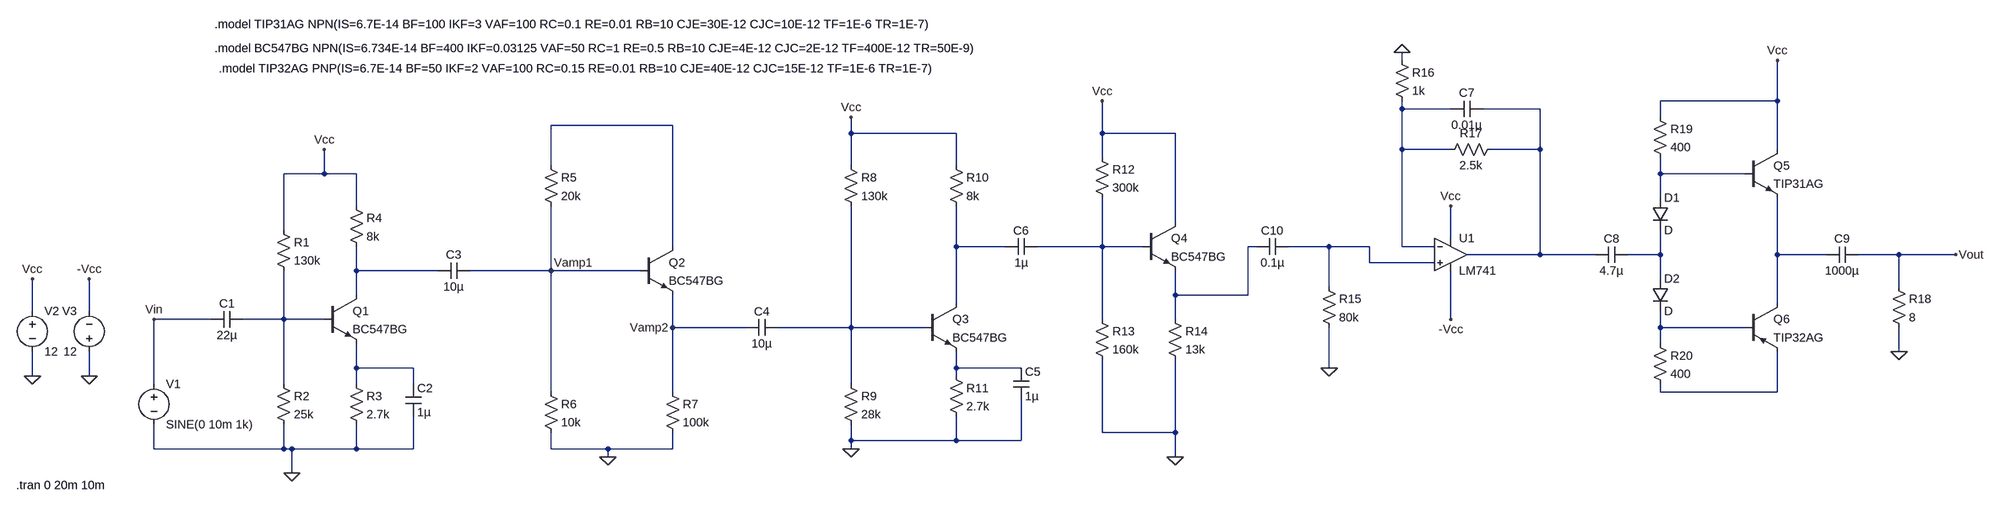
[diagram p0: schematic proje_deneme_cagatay.asc]
proje_deneme_cagatay.asc, the LTspice schematic file:
Version 4
SHEET 1 3752 680
WIRE 2512 -480 2512 -496
WIRE 3328 -400 3328 -480
WIRE 3328 -400 3040 -400
WIRE 2512 -384 2512 -400
WIRE 2608 -384 2512 -384
WIRE 2784 -384 2672 -384
WIRE 3040 -368 3040 -400
WIRE 1072 -352 832 -352
WIRE 1424 -336 1424 -368
WIRE 1632 -336 1424 -336
WIRE 1920 -336 1920 -400
WIRE 2064 -336 1920 -336
WIRE 2512 -304 2512 -384
WIRE 2608 -304 2512 -304
WIRE 2784 -304 2784 -384
WIRE 2784 -304 2688 -304
WIRE 3328 -304 3328 -400
WIRE 1920 -288 1920 -336
WIRE 832 -272 832 -352
WIRE 1424 -272 1424 -336
WIRE 1632 -272 1632 -336
WIRE 384 -256 384 -304
WIRE 384 -256 304 -256
WIRE 448 -256 384 -256
WIRE 3040 -256 3040 -288
WIRE 3264 -256 3040 -256
WIRE 3040 -208 3040 -256
WIRE 448 -192 448 -256
WIRE 2064 -160 2064 -336
WIRE 304 -144 304 -256
WIRE 2608 -128 2608 -192
WIRE 1072 -112 1072 -352
WIRE 1632 -112 1632 -192
WIRE 1728 -112 1632 -112
WIRE 1920 -112 1920 -208
WIRE 1920 -112 1792 -112
WIRE 2000 -112 1920 -112
WIRE 2224 -112 2208 -112
WIRE 2368 -112 2288 -112
WIRE 2448 -112 2368 -112
WIRE 2512 -112 2512 -304
WIRE 2576 -112 2512 -112
WIRE 2784 -96 2784 -304
WIRE 2784 -96 2640 -96
WIRE 2912 -96 2784 -96
WIRE 3040 -96 3040 -144
WIRE 3040 -96 2976 -96
WIRE 3328 -96 3328 -208
WIRE 3424 -96 3328 -96
WIRE 3568 -96 3488 -96
WIRE 3680 -96 3568 -96
WIRE 2448 -80 2448 -112
WIRE 2576 -80 2448 -80
WIRE 448 -64 448 -112
WIRE 608 -64 448 -64
WIRE 832 -64 832 -192
WIRE 832 -64 672 -64
WIRE 1008 -64 832 -64
WIRE 3040 -48 3040 -96
WIRE 2368 -32 2368 -112
WIRE 3568 -32 3568 -96
WIRE 448 -16 448 -64
WIRE 2064 -16 2064 -64
WIRE 2208 -16 2208 -112
WIRE 2208 -16 2064 -16
WIRE 1632 0 1632 -112
WIRE 3328 0 3328 -96
WIRE -192 16 -192 -48
WIRE -80 16 -80 -48
WIRE 160 32 48 32
WIRE 304 32 304 -64
WIRE 304 32 224 32
WIRE 384 32 304 32
WIRE 1920 32 1920 -112
WIRE 2064 32 2064 -16
WIRE 2608 32 2608 -64
WIRE 1072 48 1072 -16
WIRE 1216 48 1072 48
WIRE 1424 48 1424 -192
WIRE 1424 48 1280 48
WIRE 1568 48 1424 48
WIRE 3040 48 3040 16
WIRE 3264 48 3040 48
WIRE 3040 80 3040 48
WIRE 3568 96 3568 48
WIRE 448 128 448 80
WIRE 560 128 448 128
WIRE 1632 128 1632 96
WIRE 1760 128 1632 128
WIRE 2368 128 2368 48
WIRE -192 144 -192 96
WIRE -80 144 -80 96
WIRE 1632 144 1632 128
WIRE 48 160 48 32
WIRE 304 160 304 32
WIRE 448 160 448 128
WIRE 560 160 560 128
WIRE 1424 160 1424 48
WIRE 832 176 832 -64
WIRE 1072 176 1072 48
WIRE 3040 176 3040 160
WIRE 3328 176 3328 96
WIRE 3328 176 3040 176
WIRE 1920 256 1920 112
WIRE 2064 256 2064 112
WIRE 2064 256 1920 256
WIRE 1424 272 1424 240
WIRE 1632 272 1632 224
WIRE 1632 272 1424 272
WIRE 1760 272 1760 192
WIRE 1760 272 1632 272
WIRE 48 288 48 240
WIRE 304 288 304 240
WIRE 304 288 48 288
WIRE 320 288 304 288
WIRE 448 288 448 240
WIRE 448 288 320 288
WIRE 560 288 560 224
WIRE 560 288 448 288
WIRE 832 288 832 256
WIRE 944 288 832 288
WIRE 1072 288 1072 256
WIRE 1072 288 944 288
WIRE 1424 288 1424 272
WIRE 944 304 944 288
WIRE 2064 304 2064 256
WIRE 320 336 320 288
FLAG -192 144 0
FLAG 320 336 0
FLAG 944 304 0
FLAG 1424 288 0
FLAG 2064 304 0
FLAG 2368 128 0
FLAG 2512 -496 0
FLAG 3568 96 0
FLAG 3328 -480 Vcc
FLAG 2608 -192 Vcc
FLAG 2608 32 -Vcc
FLAG 3680 -96 Vout
FLAG 1920 -400 Vcc
FLAG 1424 -368 Vcc
FLAG 384 -304 Vcc
FLAG -192 -48 Vcc
FLAG -80 144 0
FLAG -80 -48 -Vcc
FLAG 48 32 Vin
FLAG 832 -64 Vamp1
FLAG 1072 48 Vamp2
SYMBOL voltage 48 144 R0
WINDOW 123 0 0 Left 0
WINDOW 39 0 0 Left 0
SYMATTR InstName V1
SYMATTR Value SINE(0 10m 1k)
SYMBOL cap 224 16 R90
WINDOW 0 0 32 VBottom 2
WINDOW 3 32 32 VTop 2
SYMATTR InstName C1
SYMATTR Value 22µ
SYMBOL npn 384 -16 R0
SYMATTR InstName Q1
SYMATTR Value BC547BG
SYMBOL res 288 -160 R0
SYMATTR InstName R1
SYMATTR Value 130k
SYMBOL res 288 144 R0
SYMATTR InstName R2
SYMATTR Value 25k
SYMBOL res 432 144 R0
SYMATTR InstName R3
SYMATTR Value 2.7k
SYMBOL cap 544 160 R0
SYMATTR InstName C2
SYMATTR Value 1µ
SYMBOL res 432 -208 R0
SYMATTR InstName R4
SYMATTR Value 8k
SYMBOL cap 672 -80 R90
WINDOW 0 0 32 VBottom 2
WINDOW 3 32 32 VTop 2
SYMATTR InstName C3
SYMATTR Value 10µ
SYMBOL voltage -192 0 R0
WINDOW 123 0 0 Left 0
WINDOW 39 0 0 Left 0
SYMATTR InstName V2
SYMATTR Value 12
SYMBOL res 816 -288 R0
SYMATTR InstName R5
SYMATTR Value 20k
SYMBOL res 816 160 R0
SYMATTR InstName R6
SYMATTR Value 10k
SYMBOL res 1056 160 R0
SYMATTR InstName R7
SYMATTR Value 100k
SYMBOL cap 1280 32 R90
WINDOW 0 0 32 VBottom 2
WINDOW 3 32 32 VTop 2
SYMATTR InstName C4
SYMATTR Value 10µ
SYMBOL npn 1008 -112 R0
SYMATTR InstName Q2
SYMATTR Value BC547BG
SYMBOL res 1408 -288 R0
SYMATTR InstName R8
SYMATTR Value 130k
SYMBOL res 1408 144 R0
SYMATTR InstName R9
SYMATTR Value 28k
SYMBOL res 1616 -288 R0
SYMATTR InstName R10
SYMATTR Value 8k
SYMBOL res 1616 128 R0
SYMATTR InstName R11
SYMATTR Value 2.7k
SYMBOL cap 1744 128 R0
SYMATTR InstName C5
SYMATTR Value 1µ
SYMBOL npn 1568 0 R0
SYMATTR InstName Q3
SYMATTR Value BC547BG
SYMBOL cap 1792 -128 R90
WINDOW 0 0 32 VBottom 2
WINDOW 3 32 32 VTop 2
SYMATTR InstName C6
SYMATTR Value 1µ
SYMBOL res 1904 -304 R0
SYMATTR InstName R12
SYMATTR Value 300k
SYMBOL res 1904 16 R0
SYMATTR InstName R13
SYMATTR Value 160k
SYMBOL res 2048 16 R0
SYMATTR InstName R14
SYMATTR Value 13k
SYMBOL npn 2000 -160 R0
SYMATTR InstName Q4
SYMATTR Value BC547BG
SYMBOL res 2352 -48 R0
SYMATTR InstName R15
SYMATTR Value 80k
SYMBOL OpAmps\\LM741 2608 -160 R0
SYMATTR InstName U1
SYMBOL res 2496 -496 R0
SYMATTR InstName R16
SYMATTR Value 1k
SYMBOL cap 2672 -400 R90
WINDOW 0 0 32 VBottom 2
WINDOW 3 32 32 VTop 2
SYMATTR InstName C7
SYMATTR Value 0.01µ
SYMBOL res 2704 -320 R90
WINDOW 0 0 56 VBottom 2
WINDOW 3 32 56 VTop 2
SYMATTR InstName R17
SYMATTR Value 2.5k
SYMBOL cap 2976 -112 R90
WINDOW 0 0 32 VBottom 2
WINDOW 3 32 32 VTop 2
SYMATTR InstName C8
SYMATTR Value 4.7µ
SYMBOL res 3552 -48 R0
SYMATTR InstName R18
SYMATTR Value 8
SYMBOL cap 3488 -112 R90
WINDOW 0 0 32 VBottom 2
WINDOW 3 32 32 VTop 2
SYMATTR InstName C9
SYMATTR Value 1000µ
SYMBOL res 3024 -384 R0
SYMATTR InstName R19
SYMATTR Value 400
SYMBOL res 3024 64 R0
SYMATTR InstName R20
SYMATTR Value 400
SYMBOL npn 3264 -304 R0
SYMATTR InstName Q5
SYMATTR Value TIP31AG
SYMBOL voltage -80 112 R180
WINDOW 0 24 96 Left 2
WINDOW 3 24 16 Left 2
WINDOW 123 0 0 Left 0
WINDOW 39 0 0 Left 0
SYMATTR InstName V3
SYMATTR Value 12
SYMBOL cap 2288 -128 R90
WINDOW 0 0 32 VBottom 2
WINDOW 3 32 32 VTop 2
SYMATTR InstName C10
SYMATTR Value 0.1µ
SYMBOL diode 3024 -208 R0
SYMATTR InstName D1
SYMBOL diode 3024 -48 R0
SYMATTR InstName D2
SYMBOL pnp 3264 0 R0
SYMATTR InstName Q6
SYMATTR Value TIP32AG
TEXT -224 360 Left 2 !.tran 0 20m 10m
TEXT 168 -504 Left 2 !.model BC547BG NPN(IS=6.734E-14 BF=400 IKF=0.03125 VAF=50 RC=1 RE=0.5 RB=10 CJE=4E-12 CJC=2E-12 TF=400E-12 TR=50E-9)
TEXT 168 -552 Left 2 !.model TIP31AG NPN(IS=6.7E-14 BF=100 IKF=3 VAF=100 RC=0.1 RE=0.01 RB=10 CJE=30E-12 CJC=10E-12 TF=1E-6 TR=1E-7)
TEXT 176 -464 Left 2 !.model TIP32AG PNP(IS=6.7E-14 BF=50 IKF=2 VAF=100 RC=0.15 RE=0.01 RB=10 CJE=40E-12 CJC=15E-12 TF=1E-6 TR=1E-7)

The netlist it stands for:
* proje_deneme_cagatay.asc
V1 Vin 0 SINE(0 10m 1k)
C1 N012 Vin 22µ
Q1 N011 N012 N015 0 BC547BG
R1 Vcc N012 130k
R2 N012 0 25k
R3 N015 0 2.7k
C2 N015 0 1µ
R4 Vcc N011 8k
C3 Vamp1 N011 10µ
V2 Vcc 0 12
R5 N003 Vamp1 20k
R6 Vamp1 0 10k
R7 Vamp2 0 100k
C4 N013 Vamp2 10µ
Q2 N003 Vamp1 Vamp2 0 BC547BG
R8 Vcc N013 130k
R9 N013 0 28k
R10 Vcc N005 8k
R11 N016 0 2.7k
C5 N016 0 1µ
Q3 N005 N013 N016 0 BC547BG
C6 N006 N005 1µ
R12 Vcc N006 300k
R13 N006 0 160k
R14 N007 0 13k
Q4 Vcc N006 N007 0 BC547BG
R15 N008 0 80k
XU1 N008 N001 Vcc -Vcc N002 LM741  ; pins In+ In- V+ V- OUT
R16 0 N001 1k
C7 N002 N001 0.01µ
R17 N002 N001 2.5k
C8 N009 N002 4.7µ
R18 Vout 0 8
C9 Vout N010 1000µ
R19 Vcc N004 400
R20 N014 N017 400
Q5 Vcc N004 N010 0 TIP31AG
V3 0 -Vcc 12
C10 N008 N007 0.1µ
D1 N004 N009 D
D2 N009 N014 D
Q6 N010 N014 N017 0 TIP32AG
.model D D
.lib standard.dio
.model NPN NPN
.model PNP PNP
.lib standard.bjt
.tran 0 20m 10m
.model BC547BG NPN(IS=6.734E-14 BF=400 IKF=0.03125 VAF=50 RC=1 RE=0.5 RB=10 CJE=4E-12 CJC=2E-12 TF=400E-12 TR=50E-9)
.model TIP31AG NPN(IS=6.7E-14 BF=100 IKF=3 VAF=100 RC=0.1 RE=0.01 RB=10 CJE=30E-12 CJC=10E-12 TF=1E-6 TR=1E-7)
.model TIP32AG PNP(IS=6.7E-14 BF=50 IKF=2 VAF=100 RC=0.15 RE=0.01 RB=10 CJE=40E-12 CJC=15E-12 TF=1E-6 TR=1E-7)
.lib LM741.lib
.backanno
.end